# EAGLE design TinyX4 (EAGLE 6.3)
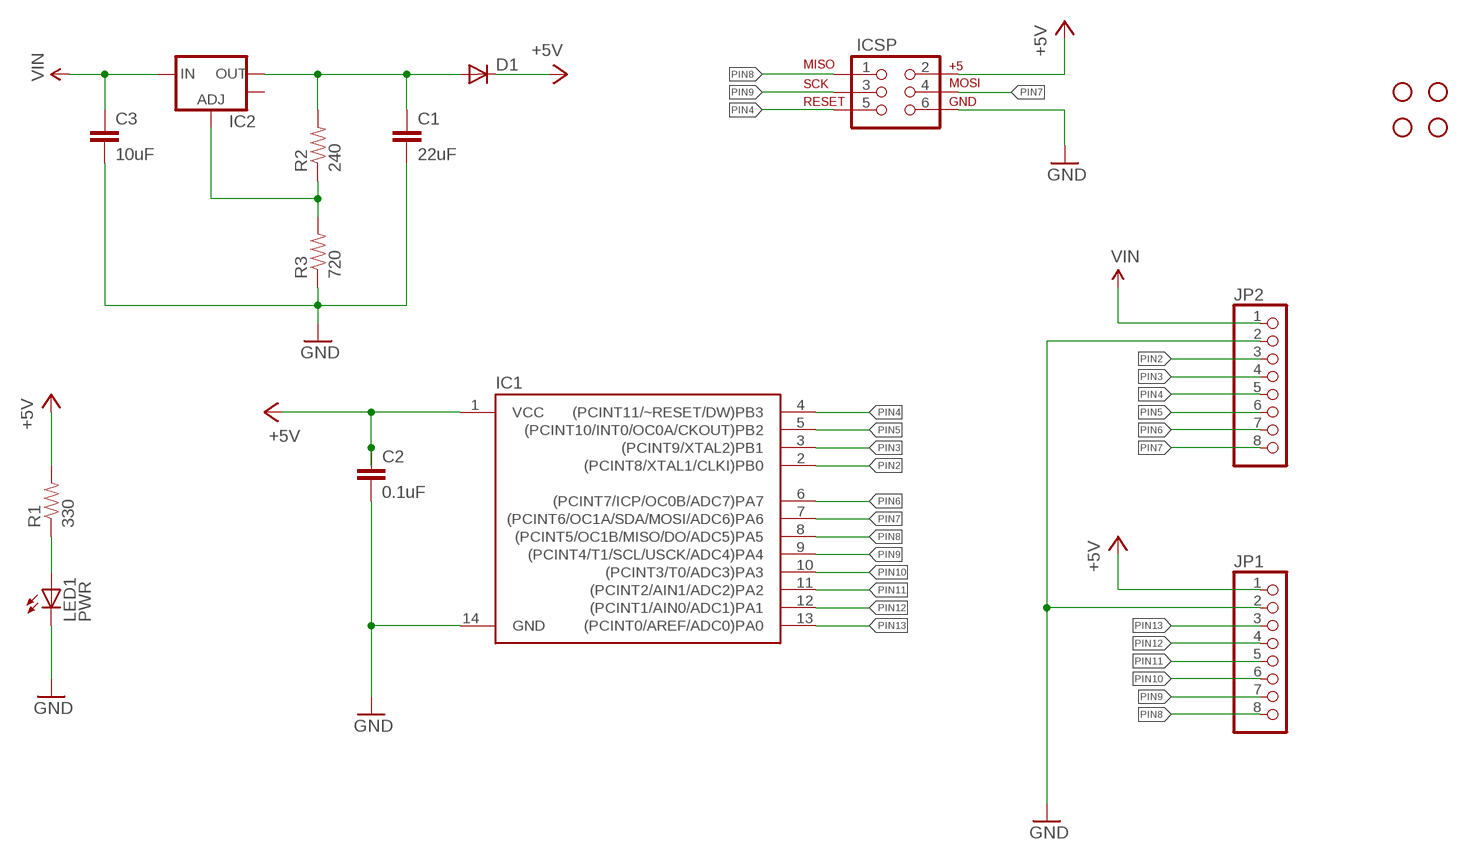
[diagram p0: schematic, sheet 1]

## Parts
C1  22uF  CAP1206  [1206]
C2  0.1uF  CAP1206  [1206]
C3  10uF  CAP1206  [1206]
D1  DIODESOD  [SOD-323]
IC1  ATTINY84ATTINY84-20PU  [DIL14]
IC2  V_REG_LM1117SOT223  [SOT223]
ICSP  AVR_SPI_PRG_6PTH  [2X3]
JP1  PINHD-1X8  [1X08]
JP2  PINHD-1X8  [1X08]
LED1  PWR  LED-RED1206  [LED-1206]
R1  330  RESISTOR1206  [1206]
R2  240  RESISTOR1206  [1206]
R3  720  RESISTOR1206  [1206]
STANDOFF1  STAND-OFFTIGHT  [STAND-OFF-TIGHT]
STANDOFF2  STAND-OFFTIGHT  [STAND-OFF-TIGHT]
STANDOFF3  STAND-OFFTIGHT  [STAND-OFF-TIGHT]
STANDOFF4  STAND-OFFTIGHT  [STAND-OFF-TIGHT]

## Nets
+5V: C2.1 D1.1(C) IC1.1(VCC) ICSP.2 JP1.1 R1.2
GND: C1.2 C2.2 C3.2 IC1.14(GND) ICSP.6 JP1.2 JP2.2 LED1.C R3.1
N$1: LED1.A R1.1
N$2: C1.1 D1.2(A) IC2.2(OUT) R2.2
N$3: IC2.1(ADJ) R2.1 R3.2
PIN2: IC1.2((PCINT8/XTAL1/CLKI)PB0) JP2.3
PIN3: IC1.3((PCINT9/XTAL2)PB1) JP2.4
PIN4: IC1.4((PCINT11/~RESET/DW)PB3) ICSP.5 JP2.5
PIN5: IC1.5((PCINT10/INT0/OC0A/CKOUT)PB2) JP2.6
PIN6: IC1.6((PCINT7/ICP/OC0B/ADC7)PA7) JP2.7
PIN7: IC1.7((PCINT6/OC1A/SDA/MOSI/ADC6)PA6) ICSP.4 JP2.8
PIN8: IC1.8((PCINT5/OC1B/MISO/DO/ADC5)PA5) ICSP.1 JP1.8
PIN9: IC1.9((PCINT4/T1/SCL/USCK/ADC4)PA4) ICSP.3 JP1.7
PIN10: IC1.10((PCINT3/T0/ADC3)PA3) JP1.6
PIN11: IC1.11((PCINT2/AIN1/ADC2)PA2) JP1.5
PIN12: IC1.12((PCINT1/AIN0/ADC1)PA1) JP1.4
PIN13: IC1.13((PCINT0/AREF/ADC0)PA0) JP1.3
VIN: C3.1 IC2.3(IN) JP2.1
Unconnected: IC2.4(OUT)

## Library data of the parts
C1-C3 = SparkFun-Capacitors:CAP: Capacitor Standard 0603 ceramic capacitor, and 0.1" leaded capacitor.
D1 = SparkFun-DiscreteSemi:DIODE: Diode These are standard reverse protection diodes and small signal diodes. SMA package can handle up to about 1A. SOD-323 can handle about 200mA. What the SOD-323 package when ordering, there are some mfgs out there that are 5-pin packages.
IC1 = SparkFun-DigitalIC:ATTINY84: Atmel 14-pin 2/4/8kB flash uC
IC2 = SparkFun-PowerIC:V_REG_LM1117: Voltage Regulator LM1117 Standard adjustable voltage regulator but in SMD form. Spark Fun Electronics SKU : COM-00595
ICSP = SparkFun-Connectors:AVR_SPI_PRG_6: AVR ISP 6 Pin This is the reduced ISP connector for AVR programming. Common on Arduino. This footprint will take up less PCB space and can be used with a 10-pin to 6-pin adapter such as SKU: BOB-08508
JP1 JP2 = pinhead:PINHD-1X8: PIN HEADER
LED1 = SparkFun-LED:LED-RED: Assorted Red LEDs LilyPad 1206- DIO-09912 1206- DIO-00809 0603- DIO-00819; PROD_ID: DIO-00809; VALUE: RED
R1 = SparkFun-Resistors:RESISTOR: Resistor Basic schematic elements and footprints for 0603, 1206, and PTH resistors.
R2 R3 = SparkFun-Passives:RESISTOR: Resistor Basic schematic elements and footprints for 0603, 1206, and PTH resistors.
STANDOFF1-STANDOFF4 = SparkFun-Electromechanical:STAND-OFF: #4 Stand Off This is the mechanical footprint for a #4 phillips button head screw. Use the keepout ring to avoid running the screw head into surrounding components. SKU : PRT-00447

## Board
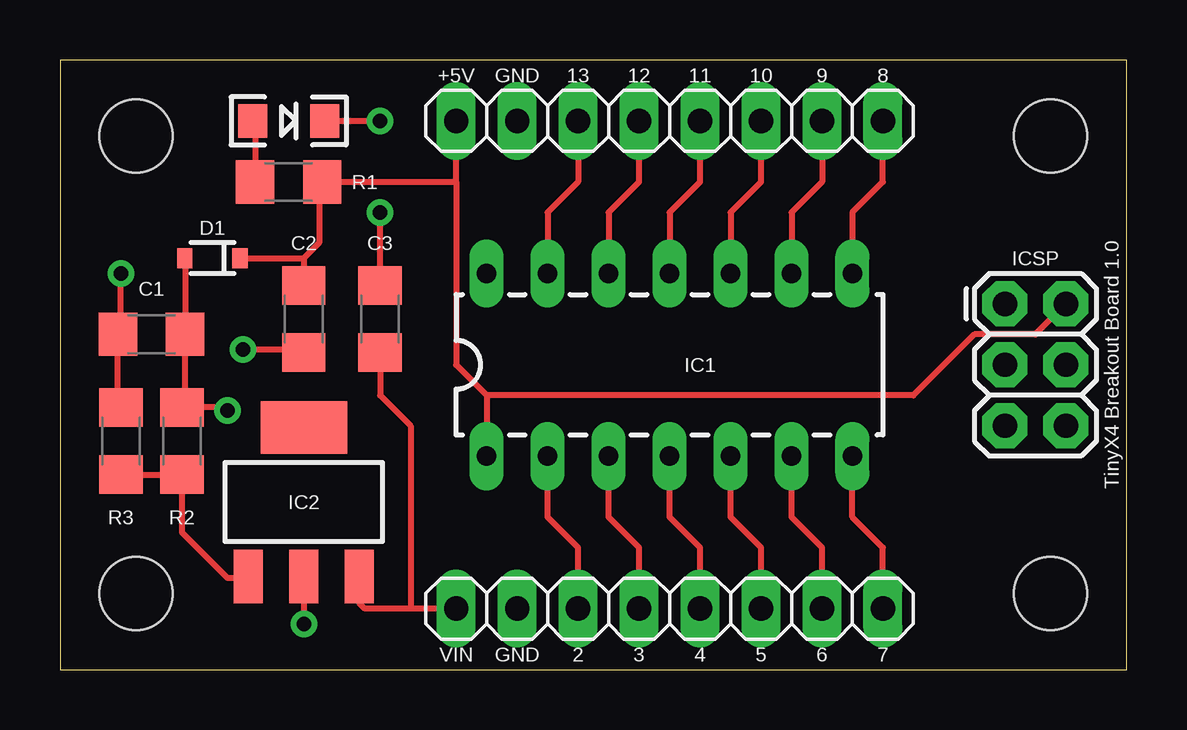
[diagram p1: board, top side]
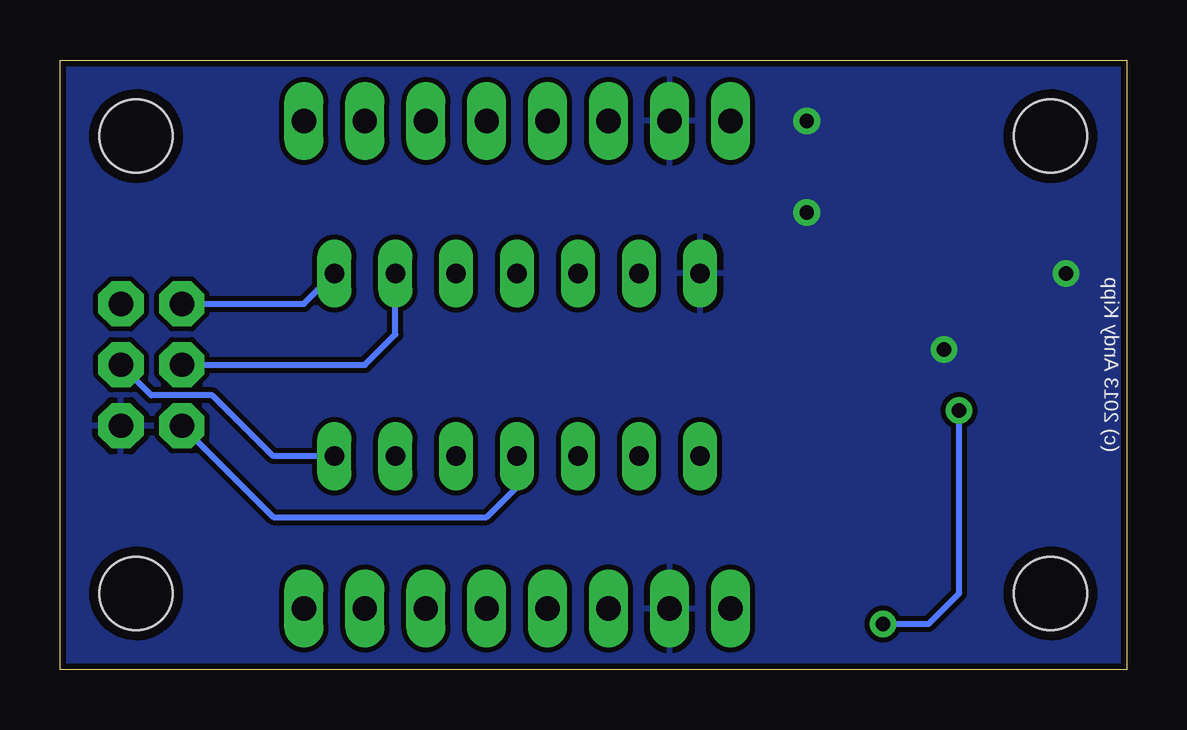
[diagram p2: board, bottom side, seen from below]

Size 44.45 x 25.4 mm. Coordinates in mm from the lower left corner, seen from the top.
Outline: 0,0 44.45,0 44.45,25.4 0,25.39 0,0
Copper layers (1*16): Top 0.035mm / dielectric 1.5mm / Bottom 0.035mm
Design rules "SparkFun": minimum track width 8mil, minimum drill 20mil, track to track 8mil, track to pad 8mil, pad to pad 8mil, via to via 8mil, smd to smd 8mil, copper to edge 10mil, drill to drill 8mil, minimum pad ring 12mil, minimum via ring 10mil, stop-mask expansion 4mil, vias tented up to drill 25mil, thermal gap 10mil

### Footprints (pad centres in the part's own frame; a part is rotated, then mirrored left to right if it is on the bottom)
1206 = smd 1.6 x 1.8: 1 -1.4,0; 2 1.4,0
SOD-323 = smd 0.63 x 0.83: 1 -1.15,0; 2 1.15,0
DIL14 = drill 0.813 long: 1 -8.89,-3.81; 2 -6.35,-3.81; 3 -3.81,-3.81; 4 -1.27,-3.81; 5 1.27,-3.81; 6 3.81,-3.81; 7 6.35,-3.81; 8 6.35,3.81; 9 3.81,3.81; 10 1.27,3.81; 11 -1.27,3.81; 12 -3.81,3.81; 13 -6.35,3.81; 14 -8.89,3.81
SOT223 = smd 1.219 x 2.235: 1 -2.311,-3.099; 2 0,-3.099; 3 2.311,-3.099 | smd 3.6 x 2.2: 4 0,3.099
2X3 = drill 1.016 pad 1.88 octagon: 1 0,0; 2 0,2.54; 3 2.54,0; 4 2.54,2.54; 5 5.08,0; 6 5.08,2.54
1X08 = drill 1.016 long: 1 -8.89,0; 2 -6.35,0; 3 -3.81,0; 4 -1.27,0; 5 1.27,0; 6 3.81,0; 7 6.35,0; 8 8.89,0
LED-1206 = smd 1.2 x 1.4: A -1.5,0; C 1.5,0
STAND-OFF-TIGHT = hole 3.048: 0,0

### Placement (x,y rotation side)
C1  3.81,13.97 180 top
C2  10.16,14.61 270 top
C3  13.34,14.61 90 top
D1  6.35,17.14 180 top
IC1  26.67,12.7 0 top
IC2  10.16,6.99 0 top
ICSP  39.37,15.24 270 top
JP1  25.4,22.86 0 top
JP2  25.4,2.54 0 top
LED1  9.53,22.86 0 top
R1  9.53,20.32 0 top
R2  5.08,9.53 90 top
R3  2.54,9.53 270 top
STANDOFF1  3.17,3.17 0 top
STANDOFF2  41.27,3.17 0 top
STANDOFF3  41.27,22.23 0 top
STANDOFF4  3.17,22.23 0 top

### Tracks (layer width: path | path; a pad name or v marks a point on that pad's centre or on a via)
+5V
  Top 0.254: ICSP.2 40.64,13.97 38.1,13.97 35.56,11.43 17.78,11.43 | 17.78,11.43 IC1.1 | 16.51,20.32 R1.2 10.79,20.19 10.79,17.78 10.16,17.14 | 16.51,20.32 16.51,12.7 17.78,11.43 | 16.51,20.32 JP1.1 | D1.1 10.16,17.14 | 10.16,17.14 C2.1
GND  (via drill 0.6)
  Top 0.254: LED1.C v13.34,22.86 | R3.1 2.41,11.05 C1.2 2.54,14.1 v2.54,16.51 | C2.2 10.03,13.34 v7.62,13.34 | C3.2 v13.34,19.05
  pour Bottom: -0.64,-0.64 45.09,-0.64 45.09,26.04 -0.64,26.04
N$1
  Top 0.254: LED1.A 8.12,22.76 R1.1
N$2  (via drill 0.6)
  Top 0.254: IC2.2 v10.16,1.91 | v6.99,10.79 6.86,10.93 R2.2 5.21,11.05 C1.1 | C1.1 5.08,14.1 | D1.2 C1.1
  Bottom 0.254: v10.16,1.91 8.26,1.91 6.99,3.17 v6.99,10.79
N$3
  Top 0.254: R3.2 R2.1 5.08,5.71 6.99,3.81 7.77,3.81 IC2.1
PIN2
  Top 0.254: JP2.3 21.59,5.08 20.32,6.35 IC1.2
PIN3
  Top 0.254: JP2.4 24.13,5.08 22.86,6.35 IC1.3
PIN4
  Top 0.254: JP2.5 26.67,5.08 25.4,6.35 IC1.4
  Bottom 0.254: ICSP.5 35.56,6.35 26.67,6.35 25.4,7.62 IC1.4
PIN5
  Top 0.254: JP2.6 29.21,5.08 27.94,6.35 IC1.5
PIN6
  Top 0.254: JP2.7 31.75,5.08 30.48,6.35 IC1.6
PIN7
  Top 0.254: JP2.8 34.29,5.08 33.02,6.35 IC1.7
  Bottom 0.254: IC1.7 35.56,8.89 38.1,11.43 40.64,11.43 ICSP.4
PIN8
  Top 0.254: IC1.8 33.02,19.05 34.29,20.32 JP1.8
  Bottom 0.254: ICSP.1 34.29,15.24 IC1.8
PIN9
  Top 0.254: JP1.7 31.75,20.32 30.48,19.05 IC1.9
  Bottom 0.254: ICSP.3 31.75,12.7 30.48,13.97 IC1.9
PIN10
  Top 0.254: IC1.10 27.94,19.05 29.21,20.32 JP1.6
PIN11
  Top 0.254: IC1.11 25.4,19.05 26.67,20.32 JP1.5
PIN12
  Top 0.254: IC1.12 22.86,19.05 24.13,20.32 JP1.4
PIN13
  Top 0.254: JP1.3 21.59,20.32 20.32,19.05 IC1.13
VIN
  Top 0.254: JP2.1 14.61,2.54 | 14.61,2.54 12.7,2.54 12.47,2.77 IC2.3 | C3.1 13.34,11.43 14.61,10.16 14.61,2.54

### Text on the board
_tsilk: +5V | GND | 13 | 12 | 11 | 10 | 9 | 8 | TinyX4 Breakout Board 1.0 | VIN | GND | 2 | 3 | 4 | 5 | 6 | 7
_bsilk: (c) 2013 Andy Kipp